# EAGLE schematic esd_fall_project rev1 (EAGLE 9.6.2)
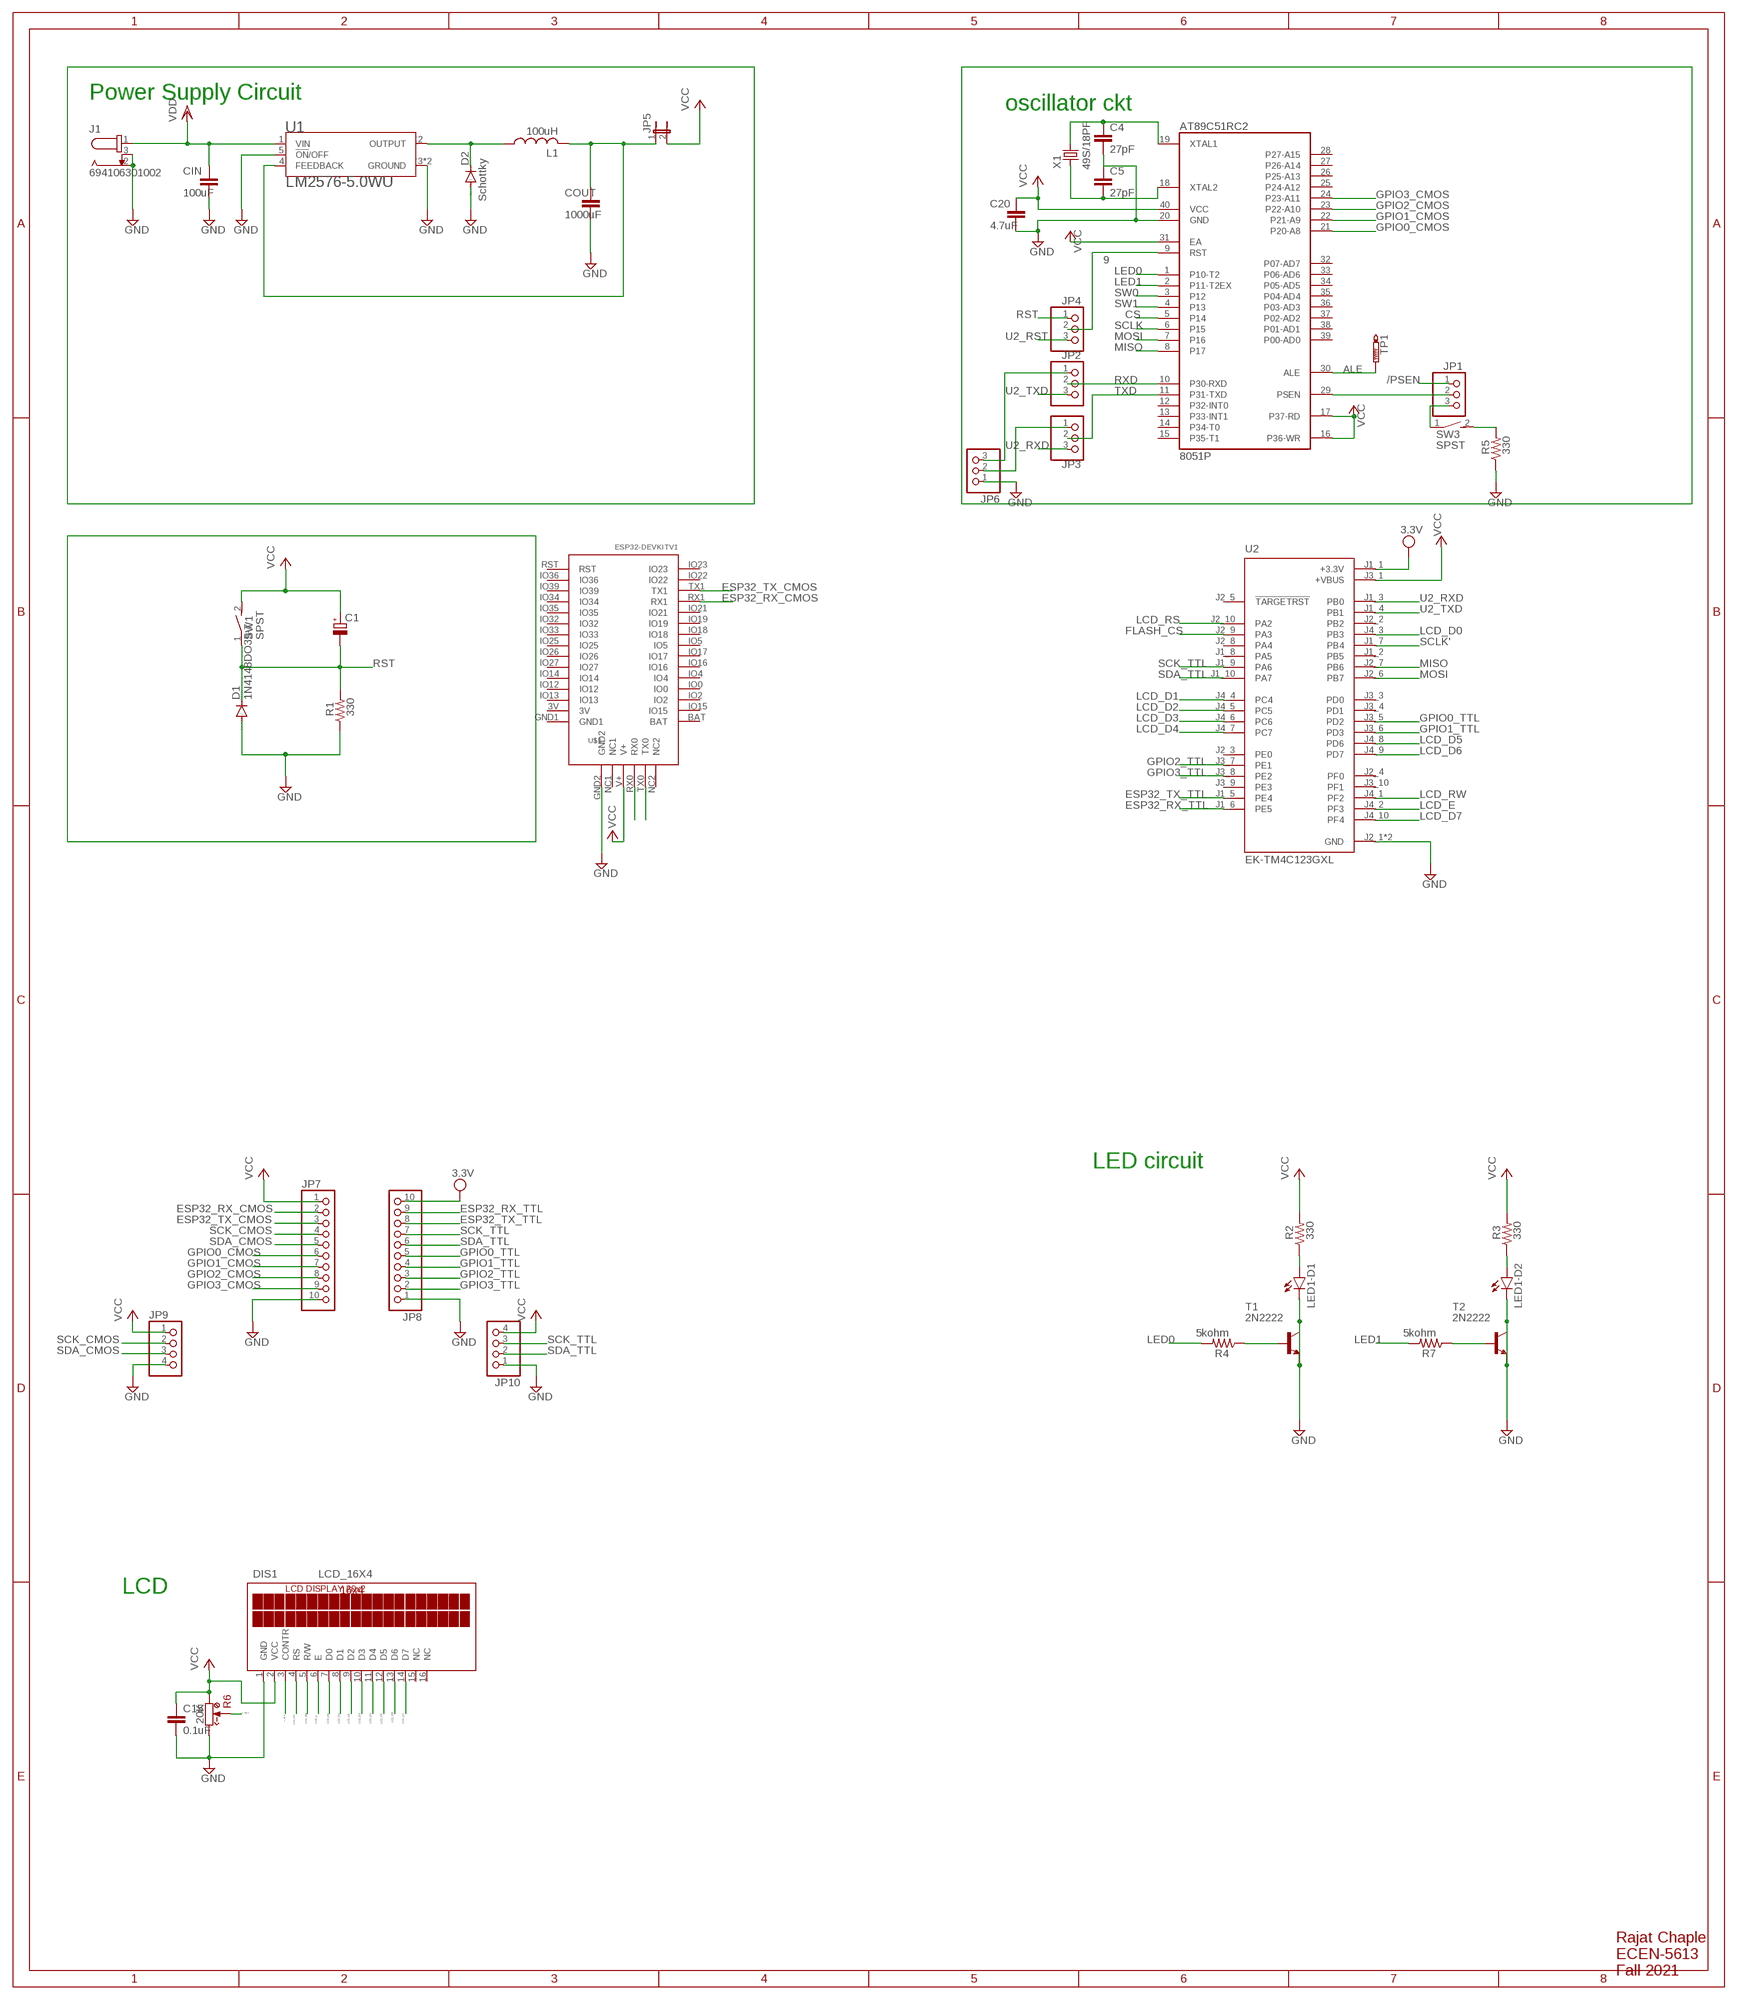
[diagram p0: schematic, sheet 1]

## Parts
AT89C51RC2  8051P  [DIL40]
C1  CPOL-EUE1.8-4  [E1,8-4]
C4  27pF  C2,5-3  [C2.5-3]
C5  27pF  C2,5-3  [C2.5-3]
C15  0.1uF  C2,5-3  [C2.5-3]
C20  4.7uF  C2,5-3  [C2.5-3]
CIN  100uF  C2,5-3  [C2.5-3]
COUT  1000uF  C2,5-3  [C2.5-3]
D1  1N4148DO35-7  [DO35-7]
D2  Schottky  1N4148DO35-7  [DO35-7]
DIS1  LCD_16X4  TUXGR_20X2  [TUXGR_20X2]
J1  694106301002  [694106301002]
JP1  PINHD-1X3  [1X03]
JP2  PINHD-1X3  [1X03]
JP3  PINHD-1X3  [1X03]
JP4  PINHD-1X3  [1X03]
JP5  JP1E  [JP1]
JP6  PINHD-1X3  [1X03]
JP7  PINHD-1X10  [1X10]
JP8  PINHD-1X10  [1X10]
JP9  PINHD-1X4  [1X04]
JP10  PINHD-1X4  [1X04]
L1  100uH  L-US0204/5  [0204/5]
LED1-D1  LED5MM  [LED5MM]
LED1-D2  LED5MM  [LED5MM]
R1  330  R-US_0204/7  [0204/7]
R2  330  R-US_0204/7  [0204/7]
R3  330  R-US_0204/7  [0204/7]
R4  5kohm  R-US_0204/7  [0204/7]
R5  330  R-US_0204/7  [0204/7]
R6  20K  100K(64W/Y)  [64W]
R7  5kohm  R-US_0204/7  [0204/7]
SW1  SPST  DS01E  [DS-01]
SW3  SPST  DS01E  [DS-01]
T1  2N2222  [TO18]
T2  2N2222  [TO18]
TP1  PTR1B2,54  [B2,54]
U1  LM2576-5.0WU  [DPAK6P170_1524X459L254X81N]
U2  EK-TM4C123GXL  [MODULE_EK-TM4C123GXL]
U$1  ESP32DEVKITV1  [ESP32-DEVKITV1]
X1  49S/18PF  [XTAL_HC49]

## Nets
9: AT89C51RC2.9(RST) JP4.2
/PSEN: JP1.1
ALE: AT89C51RC2.30(ALE) TP1.TP
CS: AT89C51RC2.5(P14)
ESP32_RX_CMOS: JP7.2 U$1.RX1
ESP32_RX_TTL: JP8.9 U2.J1_6(PE5)
ESP32_TX_CMOS: JP7.3 U$1.TX1
ESP32_TX_TTL: JP8.8 U2.J1_5(PE4)
FLASH_CS: U2.J2_9(PA3)
GND: AT89C51RC2.20(GND) C4.2 C5.1 C15.2 C20.2 CIN.2 COUT.2 D1.A D2.A DIS1.1(GND) J1.2 J1.3 JP6.1 JP7.10 JP8.1 JP9.4 JP10.1 LED1-D1.K(C) LED1-D2.K(C) R1.1 R5.1 R6.3(CW) T1.1(E) T1.3(C) T2.1(E) T2.3(C) U1.3(GROUND) U1.5(!ON!/OFF) U1.6(GROUND) U2.J2_1(GND) U2.J3_2(GND) U$1.GND2
GPIO0_CMOS: AT89C51RC2.21(P20-A8) JP7.6
GPIO0_TTL: JP8.5 U2.J3_5(PD2)
GPIO1_CMOS: AT89C51RC2.22(P21-A9) JP7.7
GPIO1_TTL: JP8.4 U2.J3_6(PD3)
GPIO2_CMOS: AT89C51RC2.23(P22-A10) JP7.8
GPIO2_TTL: JP8.3 U2.J3_7(PE1)
GPIO3_CMOS: AT89C51RC2.24(P23-A11) JP7.9
GPIO3_TTL: JP8.2 U2.J3_8(PE2)
LCD_D0: DIS1.7(D0) U2.J4_3(PB3)
LCD_D1: DIS1.8(D1) U2.J4_4(PC4)
LCD_D2: DIS1.9(D2) U2.J4_5(PC5)
LCD_D3: DIS1.10(D3) U2.J4_6(PC6)
LCD_D4: DIS1.11(D4) U2.J4_7(PC7)
LCD_D5: DIS1.12(D5) U2.J4_8(PD6)
LCD_D6: DIS1.13(D6) U2.J4_9(PD7)
LCD_D7: DIS1.14(D7) U2.J4_10(PF4)
LCD_E: DIS1.6(E) U2.J4_2(PF3)
LCD_RS: DIS1.4(RS) U2.J2_10(PA2)
LCD_RW: DIS1.5(R/W) U2.J4_1(PF2)
LED0: AT89C51RC2.1(P10-T2) R4.2
LED1: AT89C51RC2.2(P11-T2EX) R7.2
MISO: AT89C51RC2.8(P17) U2.J2_7(PB6)
MOSI: AT89C51RC2.7(P16) U2.J2_6(PB7)
N$1: R7.1 T2.2(B)
N$2: LED1-D2.A R3.1
N$3: COUT.1 JP5.1 L1.2 U1.4(FEEDBACK)
N$4: D2.C L1.1 U1.2(OUTPUT)
N$5: JP2.1 JP6.3
N$6: JP3.1 JP6.2
N$7: R4.1 T1.2(B)
N$8: AT89C51RC2.19(XTAL1) C4.1 X1.2
N$9: AT89C51RC2.18(XTAL2) C5.2 X1.1
N$10: LED1-D1.A R2.1
N$13: AT89C51RC2.29(PSEN) JP1.2
N$14: U$1.RX0
N$15: R6.S(W) R6.S@1(W)
N$16: U$1.TX0
N$35: R5.2 SW3.2
N$36: JP1.3 SW3.1
RST: C1.- D1.C JP4.1 R1.2 SW1.1
RXD: AT89C51RC2.10(P30-RXD) JP2.2
SCK_CMOS: JP7.4 JP9.2
SCK_TTL: JP8.7 JP10.3 U2.J1_9(PA6)
SCLK: AT89C51RC2.6(P15)
SCLK': U2.J1_7(PB4)
SDA_CMOS: JP7.5 JP9.3
SDA_TTL: JP8.6 JP10.2 U2.J1_10(PA7)
SW0: AT89C51RC2.3(P12)
SW1: AT89C51RC2.4(P13)
TXD: AT89C51RC2.11(P31-TXD) JP3.2
U2_RST: JP4.3
U2_RXD: JP3.3 U2.J1_3(PB0)
U2_TXD: JP2.3 U2.J1_4(PB1)
V_RES: DIS1.3(CONTR)
VCC: AT89C51RC2.16(P36-WR) AT89C51RC2.17(P37-RD) AT89C51RC2.31(EA) AT89C51RC2.40(VCC) C1.+ C15.1 C20.1 DIS1.2(VCC) JP5.2 JP7.1 JP9.1 JP10.4 R2.2 R3.2 R6.1(CCW) SW1.2 U2.J3_1(+VBUS) U$1.V+
VDD: CIN.1 J1.1 JP8.10 U1.1(VIN) U2.J1_1(+3.3V) ; supply symbol labelled 3.3V
Unconnected: AT89C51RC2.12(P32-INT0) AT89C51RC2.13(P33-INT1) AT89C51RC2.14(P34-T0) AT89C51RC2.15(P35-T1) AT89C51RC2.25(P24-A12) AT89C51RC2.26(P25-A13) AT89C51RC2.27(P26-A14) AT89C51RC2.28(P27-A15) AT89C51RC2.32(P07-AD7) AT89C51RC2.33(P06-AD6) AT89C51RC2.34(P05-AD5) AT89C51RC2.35(P04-AD4) AT89C51RC2.36(P03-AD3) AT89C51RC2.37(P02-AD2) AT89C51RC2.38(P01-AD1) AT89C51RC2.39(P00-AD0) DIS1.15(NC) DIS1.16(NC) U2.J1_2(PB5) U2.J1_8(PA5) U2.J2_2(PB2) U2.J2_3(PE0) U2.J2_4(PF0) U2.J2_5(!TARGETRST) U2.J2_8(PA4) U2.J3_3(PD0) U2.J3_4(PD1) U2.J3_9(PE3) U2.J3_10(PF1) U$1.3V U$1.BAT U$1.GND1 U$1.IO0 U$1.IO2 U$1.IO4 U$1.IO5 U$1.IO12 U$1.IO13 U$1.IO14 U$1.IO15 U$1.IO16 U$1.IO17 U$1.IO18 U$1.IO19 U$1.IO21 U$1.IO22 U$1.IO23 U$1.IO25 U$1.IO26 U$1.IO27 U$1.IO32 U$1.IO33 U$1.IO34 U$1.IO35 U$1.IO36 U$1.IO39 U$1.NC1 U$1.NC2 U$1.RST

## Notes on the sheet
- Power Supply Circuit
- oscillator ckt
- LED circuit
- LCD | 16x4
- Rajat Chaple
  ECEN-5613
  Fall 2021

## Library data of the parts
AT89C51RC2 = micro-intel:8051: (CHMOS) SINGLE-CHIP 8-BIT MICROCONTROLLER 80C31BH / 80C51 BH / 87C51 MCS 51 Source: http://apps.intel.com .. 27041907.pdf; OC_FARNELL: unknown; OC_NEWARK: unknown
C1 = rcl:CPOL-EU: POLARIZED CAPACITOR, European symbol; SPICEPREFIX: C
C4 C5 C15 C20 CIN COUT = capacitor-wima:C: CAPACITOR naming: grid - package width
D1 D2 = diode:1N4148: DIODE high speed (Philips)
DIS1 = display-lcd:TUXGR_20X2: Tuxgraphics LCD display 20x2 characters reflective, without background light Source: tuxgr_20x2.pdf; OC_FARNELL: unknown; OC_NEWARK: unknown
J1 = DC Power Jacks:694106301002: CONN PWR JACK 2.1X5.5MM SOLDER Manufacturer's datasheet <https://katalog.we-online.de/em/datasheet/6941xx301002.pdf>; CREATED_BY: PCBLayout.com; DIGIKEY_PART_NUMBER: 732-5930-ND; MANUFACTURER: Wurth Electronics Inc.; MPN: 694106301002
JP1-JP4 JP6 = pinhead:PINHD-1X3: PIN HEADER
JP5 = jumper:JP1E: JUMPER
JP7 JP8 = pinhead:PINHD-1X10: PIN HEADER
JP9 JP10 = pinhead:PINHD-1X4: PIN HEADER
L1 = rcl:L-US: INDUCTOR, American symbol; SPICEPREFIX: L
LED1-D1 LED1-D2 = led:LED: LED OSRAM: - CHIPLED LG R971, LG N971, LY N971, LG Q971, LY Q971, LO R971, LY R971 LH N974, LH R974 LS Q976, LO Q976, LY Q976 LO Q996 - Hyper CHIPLED LW Q18S LB Q993, LB Q99A, LB R99A - SideLED LS A670, LO A670, LY A670, LG A670, LP A670 LB A673, LV A673, LT A673, LW A673 LH A674 LY A675 LS A676, LA A676, LO A676, LY A676, LW A676 LS A679, LY A679, LG A679 - Hyper Micro SIDELED® LS Y876, LA Y876, LO Y876, LY Y876 LT Y87S - SmartLED LW L88C, LW L88S LB L89C, LB L89S, LG L890 LS L89K, LO L89K, LY L89K LS L896, LA L896, LO L896, LY L896 - TOPLED LS T670, LO T670, LY T670, LG T670, LP T670 LSG T670, LSP T670, LSY T670, LOP T670, LYG T670 LG T671, LOG T671, LSG T671 LB T673, LV T673, LT T673, LW T673 LH T674 LS T676, LA T676, LO T676, LY T676, LB T676, LH T676, LSB T676, LW T676 LB T67C, LV T67C, LT T67C, LS T67K, LO T67K, LY T67K, LW E67C LS E67B, LA E67B, LO E67B, LY E67B, LB E67C, LV E67C, LT E67C LW T67C LS T679, LY T679, LG T679 LS T770, LO T770, LY T770, LG T770, LP T770 LB T773, LV T773, LT T773, LW T773 LH T774 LS E675, LA E675, LY E675, LS T675 LS T776, LA T776, LO T776, LY T776, LB T776 LHGB T686 LT T68C, LB T68C - Hyper Mini TOPLED® LB M676 - Mini TOPLED Santana® LG M470 LS M47K, LO M47K, LY M47K Source: http://www.osram.convergy.de LUXEON: - LUMILED® LXK2-PW12-R00, LXK2-PW12-S00, LXK2-PW14-U00, LXK2-PW14-V00 LXK2-PM12-R00, LXK2-PM12-S00, LXK2-PM14-U00 LXK2-PE12-Q00, LXK2-PE12-R00, LXK2-PE12-S00, LXK2-PE14-T00, LXK2-PE14-U00 LXK2-PB12-K00, LXK2-PB12-L00, LXK2-PB12-M00, LXK2-PB14-N00, LXK2-PB14-P00, LXK2-PB14-Q00 LXK2-PR12-L00, LXK2-PR12-M00, LXK2-PR14-Q00, LXK2-PR14-R00 LXK2-PD12-Q00, LXK2-PD12-R00, LXK2-PD12-S00 LXK2-PH12-R00, LXK2-PH12-S00 LXK2-PL12-P00, LXK2-PL12-Q00, LXK2-PL12-R00 Source: www.luxeon.com KINGBRIGHT: KA-3528ASYC Source: www.kingbright.com
R1-R5 R7 = rcl:R-US_: RESISTOR, American symbol; SPICEPREFIX: R
R6 = potentiometers:?(64W/Y)
SW1 SW3 = switch-dil:DS01E: DIL/CODE SWITCH; OC_FARNELL: unknown; OC_NEWARK: unknown
T1 T2 = transistor:2N2222: NPN TRANSISTOR
TP1 = testpad:PTR1: TEST PIN
U1 = LM2576-5.0WU:LM2576-5.0WU: LM2576 Series 40 V 52 kHz 3 A Simple Step-Down Buck Regulator - TO-263-5 Check prices <https://pricing.snapeda.com/parts/LM2576-5.0WU-TR/Microchip/view-part?ref=eda>; AVAILABILITY: In Stock; DESCRIPTION: Buck Switching Regulator IC Positive Fixed 5V 1 Output 3A TO-263-6, D²Pak (5 Leads + Tab), TO-263BA; MF: Microchip; MP: LM2576-5.0WU-TR; PACKAGE: TO-263-5 Microchip; PRICE: None; PURCHASE-URL: https://pricing.snapeda.com/search/part/LM2576-5.0WU-TR/?ref=eda
U2 = EK-TM4C123GXL:EK-TM4C123GXL: ARM® Cortex®-M4F Based MCU TM4C123G LaunchPad™ Evaluation Kit Check prices <https://pricing.snapeda.com/parts/EK-TM4C123GXL/Texas%20Instruments/view-part?ref=eda>; AVAILABILITY: In Stock; DESCRIPTION: ARM® Cortex®-M4F Based MCU TM4C123G LaunchPad™ Evaluation Kit; MF: Texas Instruments; MP: EK-TM4C123GXL; PACKAGE: None; PRICE: None; PURCHASE-URL: https://pricing.snapeda.com/search/part/EK-TM4C123GXL/?ref=eda
U$1 = ESP32-DEVKITV1:ESP32DEVKITV1
X1 = Crystals_Oscillators:49S/18PF: Crystal Manufacturer's datasheet <https://datasheet.octopart.com/49S-18PF-Xinhunjing-datasheet-30677139.pdf>; CREATED_BY: PCBLayout.com; MANUFACTURER: Xinhunjing; MPN: 49S/18PF; PACKAGE: SMD